# Altium schematic sheet WC_RS232.SchDoc
size A; Organization: Altium Limited; Address1: L3, 12a Rodborough Rd; Address2: Frenchs Forest; Address3: NSW; Address4: Australia 2086; DocumentNumber: 4; SheetNumber: 4; SheetTotal: 11
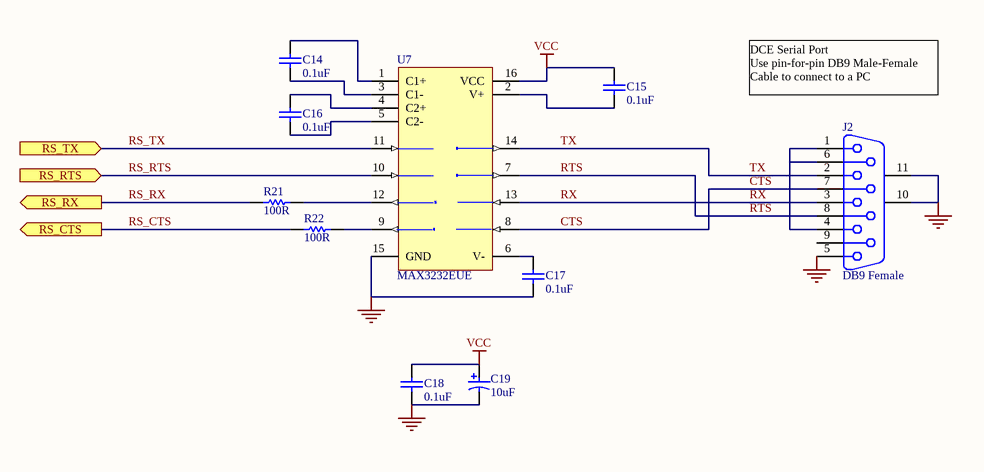
[diagram p0: WC_RS232.SchDoc]

## Parts
C14  0.1uF  [CC2012-0805]
C15  0.1uF  [CC2012-0805]
C16  0.1uF  [CC2012-0805]
C17  0.1uF  [CC2012-0805]
C18  0.1uF  [CC2012-0805]
C19  10uF  [MCCT-B]
J2  DB9 Female  [DSUB1.385-2H9]
R21  100R  [CC2012-0805]
R22  100R  [CC2012-0805]
U7  MAX3232EUE  [SO-G16]

## Ports
RS_CTS (out), RS_RTS (in), RS_RX (out), RS_TX (in)

## Nets
GND: C17.2 C18.2 C19.2 J2.5 J2.10(MH1) J2.11(MH2) U7.15(GND)
VCC: C15.1 C18.1 C19.1 U7.16(VCC)
CTS: J2.7 U7.8(R2IN)
RS_CTS: R22.1 ; port RS_CTS
RS_RTS: U7.10(T2IN) ; port RS_RTS
RS_RX: R21.1 ; port RS_RX
RS_TX: U7.11(T1IN) ; port RS_TX
RTS: J2.8 U7.7(T2OUT)
RX: J2.3 U7.13(R1IN)
TX: J2.2 U7.14(T1OUT)
NetC14_1: C14.1 U7.1(C1+)
NetC14_2: C14.2 U7.3(C1-)
NetC15_2: C15.2 U7.2(V+)
NetC16_1: C16.1 U7.4(C2+)
NetC16_2: C16.2 U7.5(C2-)
NetC17_1: C17.1 U7.6(V-)
NetJ2_1: J2.1 J2.4 J2.6
NetR21_2: R21.2 U7.12(R1OUT)
NetR22_2: R22.2 U7.9(R2OUT)

Not connected (* = marked no-connect by the designer): J2 9

## Notes on the sheet
- DCE Serial Port
  Use pin-for-pin DB9 Male-Female
  Cable to connect to a PC
- Title
- Size:
- Date:
- A
- Number:
- Time:
- Revision:
- Sheet
- of
- File:

## Library data of the parts
C14-C18 = CAP: Capacitor
C19 = CAP_POLAR: Polar Capacitor
J2 = D Connector 9: Receptacle Assembly, 9 Position, Right Angle; Manufacturer: Generic Components; Package Information: Latest Revision: O; Positions: 9; Published: 15-Jun-2001; Revision: July-2002: Re-released for DXP Platform.; Datasheet: (1-Sep-1999); Package Reference: 788750; Publisher: Altium Limited; Class I: Connector; Orientation: Right Angle; Gender: Receptacle
R21 R22 = RES: Resistor
U7 = MAX3232EUE: 3.0V TO 5.5V, Low-Power, up to 1Mbps, True RS-232 Transceiver Using Four 0.1µF External Capacitor; Manufacturer: Maxim,ST; Package Information: Latest Revision: 21-0066 C; Class I: Communication; Published: 16-Jan-2001; Revision: July-2002: Re-released for DXP Platform.; Datasheet: Latest Revision: Mar-1999; Package Reference: TSSOP16; Publisher: Altium Limited; Class II: Transceiver